# Altium schematic sheet M3_Chip.SchDoc
size A
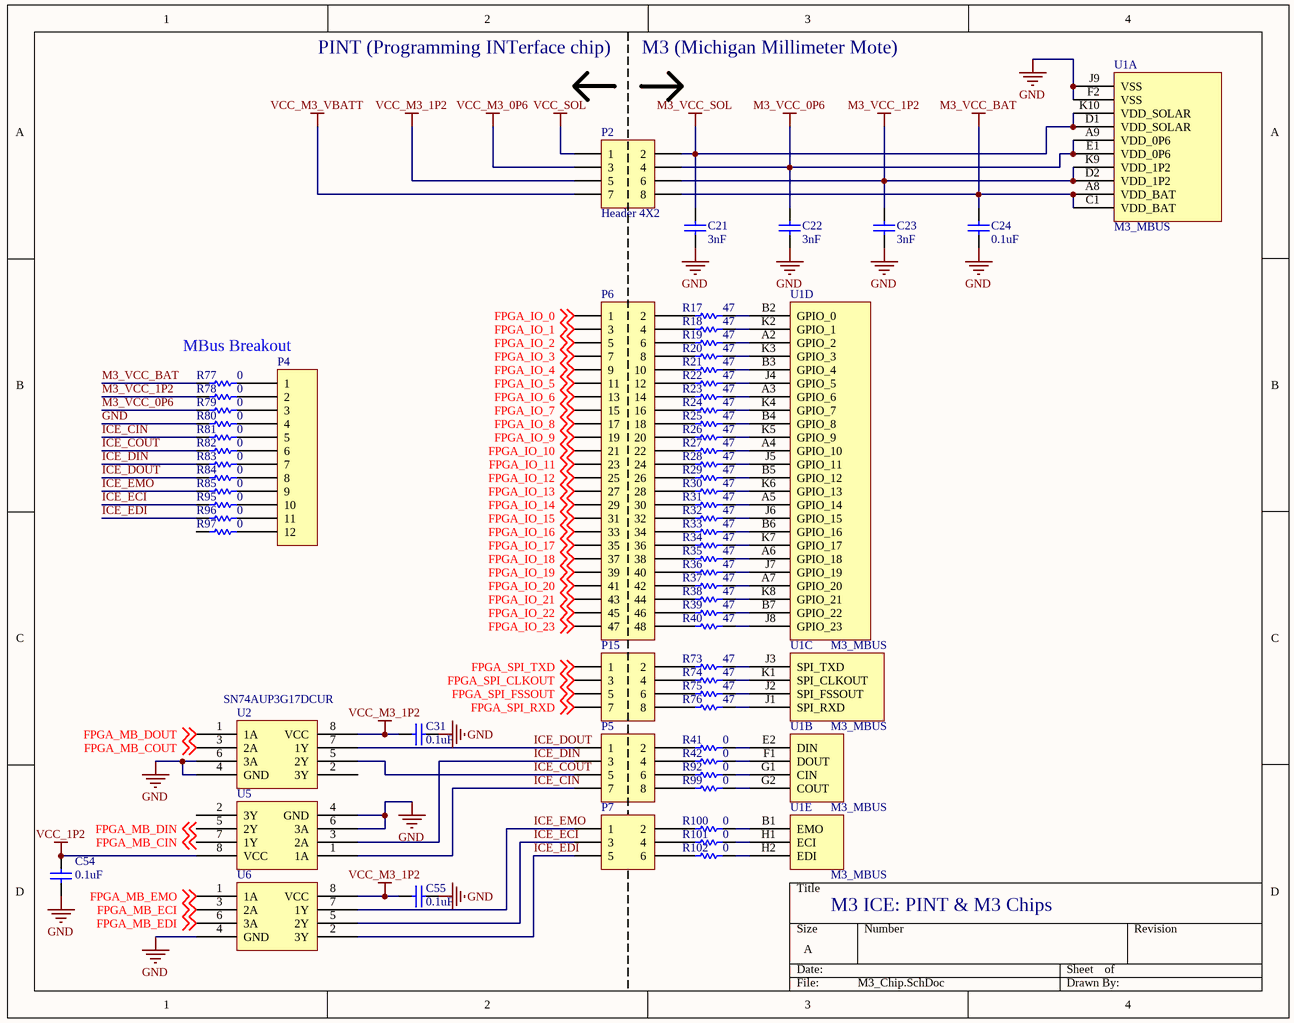
[diagram p0: M3_Chip.SchDoc]

## Parts
C21  value 3nF  [1608[0603]]  (hidden comment: Cap Semi)
C22  value 3nF  [1608[0603]]  (hidden comment: Cap Semi)
C23  value 3nF  [1608[0603]]  (hidden comment: Cap Semi)
C24  value 0.1uF  [1608[0603]]  (hidden comment: Cap Semi)
C31  value 0.1uF  [1608[0603]]  (hidden comment: Cap Semi)
C54  value 0.1uF  [1608[0603]]  (hidden comment: Cap Semi)
C55  value 0.1uF  [1608[0603]]  (hidden comment: Cap Semi)
P2  Header 4X2  [HDR2X4]
P4  MBus Breakout  [HDR1X12]  (value not drawn)
P5  Header 4X2  [HDR2X4]  (value not drawn)
P6  Header 24X2  [HDR2X24]  (value not drawn)
P7  Header 3X2  [HDR2X3]  (value not drawn)
P15  Header 4X2  [HDR2X4]  (value not drawn)
R17  value 47  [0603]  (hidden comment: Res Chip)
R18  value 47  [0603]  (hidden comment: Res Chip)
R19  value 47  [0603]  (hidden comment: Res Chip)
R20  value 47  [0603]  (hidden comment: Res Chip)
R21  value 47  [0603]  (hidden comment: Res Chip)
R22  value 47  [0603]  (hidden comment: Res Chip)
R23  value 47  [0603]  (hidden comment: Res Chip)
R24  value 47  [0603]  (hidden comment: Res Chip)
R25  value 47  [0603]  (hidden comment: Res Chip)
R26  value 47  [0603]  (hidden comment: Res Chip)
R27  value 47  [0603]  (hidden comment: Res Chip)
R28  value 47  [0603]  (hidden comment: Res Chip)
R29  value 47  [0603]  (hidden comment: Res Chip)
R30  value 47  [0603]  (hidden comment: Res Chip)
R31  value 47  [0603]  (hidden comment: Res Chip)
R32  value 47  [0603]  (hidden comment: Res Chip)
R33  value 47  [0603]  (hidden comment: Res Chip)
R34  value 47  [0603]  (hidden comment: Res Chip)
R35  value 47  [0603]  (hidden comment: Res Chip)
R36  value 47  [0603]  (hidden comment: Res Chip)
R37  value 47  [0603]  (hidden comment: Res Chip)
R38  value 47  [0603]  (hidden comment: Res Chip)
R39  value 47  [0603]  (hidden comment: Res Chip)
R40  value 47  [0603]  (hidden comment: Res Chip)
R41  value 0  [0603]  (hidden comment: Res Chip)
R42  value 0  [0603]  (hidden comment: Res Chip)
R73  value 47  [0603]  (hidden comment: Res Chip)
R74  value 47  [0603]  (hidden comment: Res Chip)
R75  value 47  [0603]  (hidden comment: Res Chip)
R76  value 47  [0603]  (hidden comment: Res Chip)
R77  value 0  [0603]  (hidden comment: Res Chip)
R78  value 0  [0603]  (hidden comment: Res Chip)
R79  value 0  [0603]  (hidden comment: Res Chip)
R80  value 0  [0603]  (hidden comment: Res Chip)
R81  value 0  [0603]  (hidden comment: Res Chip)
R82  value 0  [0603]  (hidden comment: Res Chip)
R83  value 0  [0603]  (hidden comment: Res Chip)
R84  value 0  [0603]  (hidden comment: Res Chip)
R85  value 0  [0603]  (hidden comment: Res Chip)
R92  value 0  [0603]  (hidden comment: Res Chip)
R95  value 0  [0603]  (hidden comment: Res Chip)
R96  value 0  [0603]  (hidden comment: Res Chip)
R97  value 0  [0603]  (hidden comment: Res Chip)
R99  value 0  [0603]  (hidden comment: Res Chip)
R100  value 0  [0603]  (hidden comment: Res Chip)
R101  value 0  [0603]  (hidden comment: Res Chip)
R102  value 0  [0603]  (hidden comment: Res Chip)
U1  M3_MBUS  [CPGA-65]  (parts A,B,C,D,E of 5)
U2  SN74AUP3G17DCUR  [VFSOP-8]
U5  SN74AUP3G17DCUR  [VFSOP-8]  (value not drawn)
U6  SN74AUP3G17DCUR  [VFSOP-8]  (value not drawn)

## Nets
GND: C21.1 C22.1 C23.1 C24.1 C31.1 C54.1 C55.1 R80.2 U1.F2(VSS) U1.J9(VSS) U2.4(GND) U2.6(3A) U5.4(GND) U5.6(3A) U6.4(GND)
M3_VCC_0P6: C22.2 P2.4 R79.2 U1.A9(VDD_0P6) U1.E1(VDD_0P6)
M3_VCC_1P2: C23.2 P2.6 R78.2 U1.D2(VDD_1P2) U1.K9(VDD_1P2)
M3_VCC_BAT: C24.2 P2.8 R77.2 U1.A8(VDD_BAT) U1.C1(VDD_BAT)
M3_VCC_SOL: C21.2 P2.2 U1.D1(VDD_SOLAR) U1.K10(VDD_SOLAR)
VCC_1P2: C54.2 U5.8(VCC)
VCC_M3_0P6: P2.3
VCC_M3_1P2: C31.2 C55.2 P2.5 U2.8(VCC) U6.8(VCC)
VCC_M3_VBATT: P2.7
VCC_SOL: P2.1
FPGA_IO_0: P6.1 ; off-sheet FPGA_IO_0
FPGA_IO_1: P6.3 ; off-sheet FPGA_IO_1
FPGA_IO_2: P6.5 ; off-sheet FPGA_IO_2
FPGA_IO_3: P6.7 ; off-sheet FPGA_IO_3
FPGA_IO_4: P6.9 ; off-sheet FPGA_IO_4
FPGA_IO_5: P6.11 ; off-sheet FPGA_IO_5
FPGA_IO_6: P6.13 ; off-sheet FPGA_IO_6
FPGA_IO_7: P6.15 ; off-sheet FPGA_IO_7
FPGA_IO_8: P6.17 ; off-sheet FPGA_IO_8
FPGA_IO_9: P6.19 ; off-sheet FPGA_IO_9
FPGA_IO_10: P6.21 ; off-sheet FPGA_IO_10
FPGA_IO_11: P6.23 ; off-sheet FPGA_IO_11
FPGA_IO_12: P6.25 ; off-sheet FPGA_IO_12
FPGA_IO_13: P6.27 ; off-sheet FPGA_IO_13
FPGA_IO_14: P6.29 ; off-sheet FPGA_IO_14
FPGA_IO_15: P6.31 ; off-sheet FPGA_IO_15
FPGA_IO_16: P6.33 ; off-sheet FPGA_IO_16
FPGA_IO_17: P6.35 ; off-sheet FPGA_IO_17
FPGA_IO_18: P6.37 ; off-sheet FPGA_IO_18
FPGA_IO_19: P6.39 ; off-sheet FPGA_IO_19
FPGA_IO_20: P6.41 ; off-sheet FPGA_IO_20
FPGA_IO_21: P6.43 ; off-sheet FPGA_IO_21
FPGA_IO_22: P6.45 ; off-sheet FPGA_IO_22
FPGA_IO_23: P6.47 ; off-sheet FPGA_IO_23
FPGA_MB_CIN: U5.7(1Y) ; off-sheet FPGA_MB_CIN
FPGA_MB_COUT: U2.3(2A) ; off-sheet FPGA_MB_COUT
FPGA_MB_DIN: U5.5(2Y) ; off-sheet FPGA_MB_DIN
FPGA_MB_DOUT: U2.1(1A) ; off-sheet FPGA_MB_DOUT
FPGA_MB_ECI: U6.3(2A) ; off-sheet FPGA_MB_ECI
FPGA_MB_EDI: U6.6(3A) ; off-sheet FPGA_MB_EDI
FPGA_MB_EMO: U6.1(1A) ; off-sheet FPGA_MB_EMO
FPGA_SPI_CLKOUT: P15.3 ; off-sheet FPGA_SPI_CLKOUT
FPGA_SPI_FSSOUT: P15.5 ; off-sheet FPGA_SPI_FSSOUT
FPGA_SPI_RXD: P15.7 ; off-sheet FPGA_SPI_RXD
FPGA_SPI_TXD: P15.1 ; off-sheet FPGA_SPI_TXD
ICE_CIN: P5.7 R81.2 U5.1(1A)
ICE_COUT: P5.5 R82.2 U2.5(2Y)
ICE_DIN: P5.3 R83.2 U5.3(2A)
ICE_DOUT: P5.1 R84.2 U2.7(1Y)
ICE_ECI: P7.3 R95.2 U6.5(2Y)
ICE_EDI: P7.5 R96.2 U6.2(3Y)
ICE_EMO: P7.1 R85.2 U6.7(1Y)
NetP4_1: P4.1 R77.1
NetP4_2: P4.2 R78.1
NetP4_3: P4.3 R79.1
NetP4_4: P4.4 R80.1
NetP4_5: P4.5 R81.1
NetP4_6: P4.6 R82.1
NetP4_7: P4.7 R83.1
NetP4_8: P4.8 R84.1
NetP4_9: P4.9 R85.1
NetP4_10: P4.10 R95.1
NetP4_11: P4.11 R96.1
NetP4_12: P4.12 R97.1
NetP5_2: P5.2 R41.2
NetP5_4: P5.4 R42.2
NetP5_6: P5.6 R92.2
NetP5_8: P5.8 R99.2
NetP6_2: P6.2 R17.2
NetP6_4: P6.4 R18.2
NetP6_6: P6.6 R19.2
NetP6_8: P6.8 R20.2
NetP6_10: P6.10 R21.2
NetP6_12: P6.12 R22.2
NetP6_14: P6.14 R23.2
NetP6_16: P6.16 R24.2
NetP6_18: P6.18 R25.2
NetP6_20: P6.20 R26.2
NetP6_22: P6.22 R27.2
NetP6_24: P6.24 R28.2
NetP6_26: P6.26 R29.2
NetP6_28: P6.28 R30.2
NetP6_30: P6.30 R31.2
NetP6_32: P6.32 R32.2
NetP6_34: P6.34 R33.2
NetP6_36: P6.36 R34.2
NetP6_38: P6.38 R35.2
NetP6_40: P6.40 R36.2
NetP6_42: P6.42 R37.2
NetP6_44: P6.44 R38.2
NetP6_46: P6.46 R39.2
NetP6_48: P6.48 R40.2
NetP7_2: P7.2 R100.2
NetP7_4: P7.4 R101.2
NetP7_6: P7.6 R102.2
NetP15_2: P15.2 R73.2
NetP15_4: P15.4 R74.2
NetP15_6: P15.6 R75.2
NetP15_8: P15.8 R76.2
NetR17_1: R17.1 U1.B2(GPIO_0)
NetR18_1: R18.1 U1.K2(GPIO_1)
NetR19_1: R19.1 U1.A2(GPIO_2)
NetR20_1: R20.1 U1.K3(GPIO_3)
NetR21_1: R21.1 U1.B3(GPIO_4)
NetR22_1: R22.1 U1.J4(GPIO_5)
NetR23_1: R23.1 U1.A3(GPIO_6)
NetR24_1: R24.1 U1.K4(GPIO_7)
NetR25_1: R25.1 U1.B4(GPIO_8)
NetR26_1: R26.1 U1.K5(GPIO_9)
NetR27_1: R27.1 U1.A4(GPIO_10)
NetR28_1: R28.1 U1.J5(GPIO_11)
NetR29_1: R29.1 U1.B5(GPIO_12)
NetR30_1: R30.1 U1.K6(GPIO_13)
NetR31_1: R31.1 U1.A5(GPIO_14)
NetR32_1: R32.1 U1.J6(GPIO_15)
NetR33_1: R33.1 U1.B6(GPIO_16)
NetR34_1: R34.1 U1.K7(GPIO_17)
NetR35_1: R35.1 U1.A6(GPIO_18)
NetR36_1: R36.1 U1.J7(GPIO_19)
NetR37_1: R37.1 U1.A7(GPIO_20)
NetR38_1: R38.1 U1.K8(GPIO_21)
NetR39_1: R39.1 U1.B7(GPIO_22)
NetR40_1: R40.1 U1.J8(GPIO_23)
NetR41_1: R41.1 U1.E2(DIN)
NetR42_1: R42.1 U1.F1(DOUT)
NetR73_1: R73.1 U1.J3(SPI_TXD)
NetR74_1: R74.1 U1.K1(SPI_CLKOUT)
NetR75_1: R75.1 U1.J2(SPI_FSSOUT)
NetR76_1: R76.1 U1.J1(SPI_RXD)
NetR92_1: R92.1 U1.G1(CIN)
NetR99_1: R99.1 U1.G2(COUT)
NetR100_1: R100.1 U1.B1(EMO)
NetR101_1: R101.1 U1.H1(ECI)
NetR102_1: R102.1 U1.H2(EDI)

Not connected (* = marked no-connect by the designer): R97 2; U2 2(3Y); U5 2(3Y)

## Notes on the sheet
- PINT (Programming INTerface chip)
- M3 (Michigan Millimeter Mote)
- MBus Breakout
- M3 ICE: PINT & M3 Chips

## Library data of the parts
C21-C23 = Cap Semi: Capacitor (Semiconductor SIM Model); DistPartNo: 399-7893-1-ND; ManPartNo: C0603C302K5GACTU; DigiReelNo: 399-7893-6-ND; Published: 8-Jun-2000; LatestRevisionDate: 29-May-2009; LatestRevisionNote: IPC-7351 Footprint Added.; PackageReference: C1206; Publisher: Altium Limited; PackageDescription: Chip Capacitor
C24 C31 C54 C55 = Cap Semi: Capacitor (Semiconductor SIM Model); DistPartNo: 1276-1005-1-ND; ManPartNo: CL10B104KO8NNNC; DigiReelNo: 1276-1005-6-ND; Published: 8-Jun-2000; LatestRevisionDate: 29-May-2009; LatestRevisionNote: IPC-7351 Footprint Added.; PackageReference: C1206; Publisher: Altium Limited; PackageDescription: Chip Capacitor
P2 = Header 4X2: Header, 4-Pin, Dual row; DistPartNo: A26530-04-ND; ManPartNo: 4-103328-0-04; LatestRevisionDate: 17-Jul-2002; LatestRevisionNote: Re-released for DXP Platform.; Publisher: Altium Limited
P4 = Header 12: Header, 12-Pin; DistPartNo: A26514-12-ND; ManPartNo: 4-103327-0-12; LatestRevisionDate: 17-Jul-2002; LatestRevisionNote: Re-released for DXP Platform.; Publisher: Altium Limited
P5 P15 = Header 4X2: Header, 4-Pin, Dual row; ManPartNo: 4-103328-0-04; DistPartNo: A26530-04-ND; LatestRevisionDate: 17-Jul-2002; LatestRevisionNote: Re-released for DXP Platform.; Publisher: Altium Limited
P6 = Header 24X2: Header, 24-Pin, Dual row; ManPartNo: 4-103328-0-24; DistPartNo: A26530-24-ND; LatestRevisionDate: 17-Jul-2002; LatestRevisionNote: Re-released for DXP Platform.; Publisher: Altium Limited
P7 = Header 3X2: Header, 3-Pin, Dual row; DistPartNo: A26525-03-ND; ManPartNo: 4-103777-0-03; LatestRevisionDate: 17-Jul-2002; LatestRevisionNote: Re-released for DXP Platform.; Publisher: Altium Limited
R17-R40 R73-R76 = Res Chip: Semiconductor Resistor; DistPartNo: P47GCT-ND; ManPartNo: ERJ-3GEYJ470V; DigiReelNo: P47GDKR-ND; Published: 8-Jun-2000; LatestRevisionDate: 17-Jul-2002; LatestRevisionNote: Re-released for DXP Platform.; PackageReference: AXIAL-0.5; Publisher: Altium Limited; PackageDescription: Axial Device, Thru-Hole; 2 Leads; 0.5 in Pin Spacing
R41 R42 R77-R85 R92 R95-R97 R99-R102 = Res Chip: Semiconductor Resistor; DistPartNo: P0.0GCT-ND; ManPartNo: ERJ-3GEY0R00V; DigiReelNo: P0.0GDKR-ND; Published: 8-Jun-2000; LatestRevisionDate: 17-Jul-2002; LatestRevisionNote: Re-released for DXP Platform.; PackageReference: AXIAL-0.5; Publisher: Altium Limited; PackageDescription: Axial Device, Thru-Hole; 2 Leads; 0.5 in Pin Spacing
U1 = M3_MBUS: DistPartNo: 3M5066-ND; ManPartNo: 200-6310-9UN-1900
U2 U5 U6 = SN74AUP3G17DCUR: DistPartNo: 296-25596-1-ND; DigiReelNo: 296-25596-6-ND; ManPartNo: SN74AUP3G17DCUR